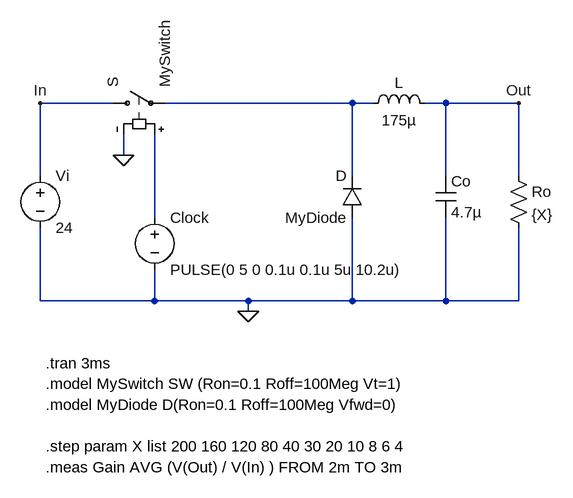
[diagram p0: schematic Buck Converter Ideale Guadagno vs. Corrente.asc]
Buck Converter Ideale Guadagno vs. Corrente.asc, the LTspice schematic file:
Version 4
SHEET 1 880 680
WIRE -272 -64 -384 -64
WIRE 96 -64 -192 -64
WIRE 128 -64 96 -64
WIRE 240 -64 208 -64
WIRE 352 -64 240 -64
WIRE -256 16 -256 -16
WIRE -384 48 -384 -64
WIRE 96 48 96 -64
WIRE 240 48 240 -64
WIRE 352 48 352 -64
WIRE -208 112 -208 -16
WIRE -384 240 -384 128
WIRE -208 240 -208 192
WIRE -208 240 -384 240
WIRE -64 240 -208 240
WIRE 96 240 96 112
WIRE 96 240 -64 240
WIRE 240 240 240 112
WIRE 240 240 96 240
WIRE 352 240 352 128
WIRE 352 240 240 240
WIRE -64 256 -64 240
FLAG -64 256 0
FLAG -256 16 0
FLAG -384 -64 In
FLAG 352 -64 Out
SYMBOL ind 112 -48 R270
WINDOW 0 32 56 VTop 2
WINDOW 3 5 56 VBottom 2
SYMATTR InstName L
SYMATTR Value 175µ
SYMBOL cap 224 48 R0
SYMATTR InstName Co
SYMATTR Value 4.7µ
SYMBOL voltage -208 96 R0
WINDOW 123 0 0 Left 2
WINDOW 39 0 0 Left 2
SYMATTR InstName Clock
SYMATTR Value PULSE(0 5 0 0.1u 0.1u 5u 10.2u)
SYMBOL voltage -384 32 R0
WINDOW 123 0 0 Left 2
WINDOW 39 0 0 Left 2
SYMATTR InstName Vi
SYMATTR Value 24
SYMBOL sw -288 -64 R270
SYMATTR InstName S
SYMATTR Value MySwitch
SYMBOL diode 112 112 R180
WINDOW 0 24 64 Left 2
WINDOW 3 24 0 Left 2
SYMATTR InstName D
SYMATTR Value MyDiode
SYMBOL res 336 32 R0
SYMATTR InstName Ro
SYMATTR Value {X}
TEXT -376 336 Left 2 !.tran 3ms
TEXT -376 368 Left 2 !.model MySwitch SW (Ron=0.1 Roff=100Meg Vt=1)
TEXT -376 400 Left 2 !.model MyDiode D(Ron=0.1 Roff=100Meg Vfwd=0)
TEXT -376 464 Left 2 !.step param X list 200 160 120 80 40 30 20 10 8 6 4
TEXT -376 496 Left 2 !.meas Gain AVG (V(Out) / V(In) ) FROM 2m TO 3m

The netlist it stands for:
* Buck Converter Ideale Guadagno vs. Corrente.asc
L N001 Out 175µ
Co Out 0 4.7µ
V§Clock N002 0 PULSE(0 5 0 0.1u 0.1u 5u 10.2u)
Vi In 0 24
S In N001 N002 0 MySwitch
D 0 N001 MyDiode
Ro Out 0 {X}
.model D D
.lib standard.dio
.tran 3ms
.model MySwitch SW (Ron=0.1 Roff=100Meg Vt=1)
.model MyDiode D(Ron=0.1 Roff=100Meg Vfwd=0)
.step param X list 200 160 120 80 40 30 20 10 8 6 4
.meas Gain AVG (V(Out) / V(In) ) FROM 2m TO 3m
.backanno
.end